# Altium schematic sheet HSADDAPower.SchDoc
size A4; SheetNumber: 1; SheetTotal: 4
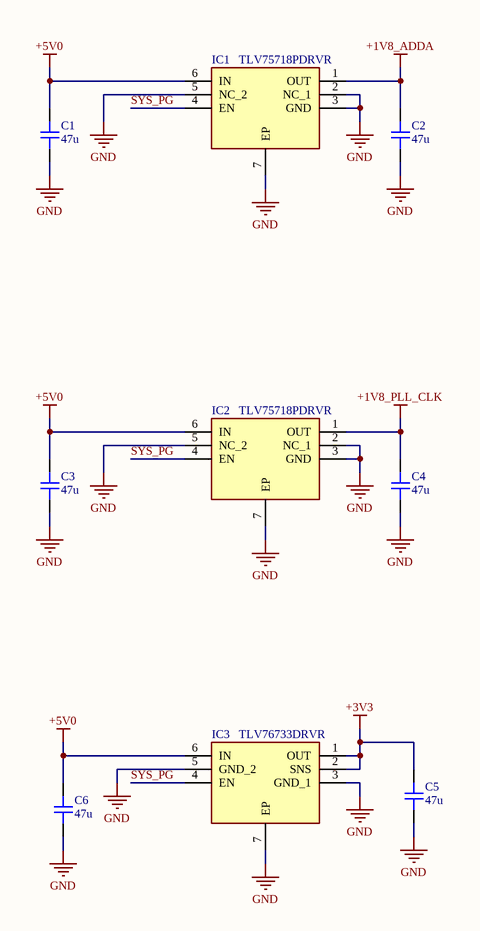
[diagram p0: HSADDAPower.SchDoc]

## Parts
C1  47u  [CAP_0805]
C2  47u  [CAP_0805]
C3  47u  [CAP_0805]
C4  47u  [CAP_0805]
C5  47u  [CAP_0805]
C6  47u  [CAP_0805]
IC1  TLV75718PDRVR  [SON65P200X200X80-7N]
IC2  TLV75718PDRVR  [SON65P200X200X80-7N]
IC3  TLV76733DRVR  [SON65P200X200X80-7N]

## Nets
+1V8_ADDA: C2.2 IC1.1(OUT)
+1V8_PLL_CLK: C4.2 IC2.1(OUT)
+3V3: C5.2 IC3.1(OUT) IC3.2(SNS)
+5V0: C1.2 C3.2 C6.2 IC1.6(IN) IC2.6(IN) IC3.6(IN)
GND: C1.1 C2.1 C3.1 C4.1 C5.1 C6.1 IC1.2(NC_1) IC1.3(GND) IC1.5(NC_2) IC1.7(EP) IC2.2(NC_1) IC2.3(GND) IC2.5(NC_2) IC2.7(EP) IC3.3(GND_1) IC3.5(GND_2) IC3.7(EP)
SYS_PG: IC1.4(EN) IC2.4(EN) IC3.4(EN)

## Library data of the parts
C1-C6 = CAP_0805: Capacitor SMD 0805; Manufacturer: *; Manufacturer Part Number: *; Distributor Link: *; LCSC: *; Rating: *; Dielectric: *
IC1 IC2 = TLV75718PDRVR: Integrated Circuit; Manufacturer_Name: Texas Instruments; Datasheet Link: http://www.ti.com/lit/gpn/tlv757p; Height: 0.8mm; Manufacturer_Part_Number: TLV75718PDRVR; Mouser Part Number: 595-TLV75718PDRVR; Mouser Price/Stock: https://www.mouser.co.uk/ProductDetail/Texas-Instruments/TLV75718PDRVR?qs=W0yvOO0ixfFI17Xta%2FsYdw%3D%3D; Arrow Part Number: TLV75718PDRVR; Arrow Price/Stock: https://www.arrow.com/en/products/tlv75718pdrvr/texas-instruments
IC3 = TLV76733DRVR: Integrated Circuit; Manufacturer_Name: Texas Instruments; Datasheet Link: http://www.ti.com/lit/gpn/TLV767; Height: 0.8mm; Manufacturer_Part_Number: TLV76733DRVR; Mouser Part Number: 595-TLV76733DRVR; Mouser Price/Stock: https://www.mouser.co.uk/ProductDetail/Texas-Instruments/TLV76733DRVR?qs=9r4v7xj2LnmGIkwTuPlHig%3D%3D; Arrow Part Number: TLV76733DRVR; Arrow Price/Stock: https://www.arrow.com/en/products/tlv76733drvr/texas-instruments?region=nac